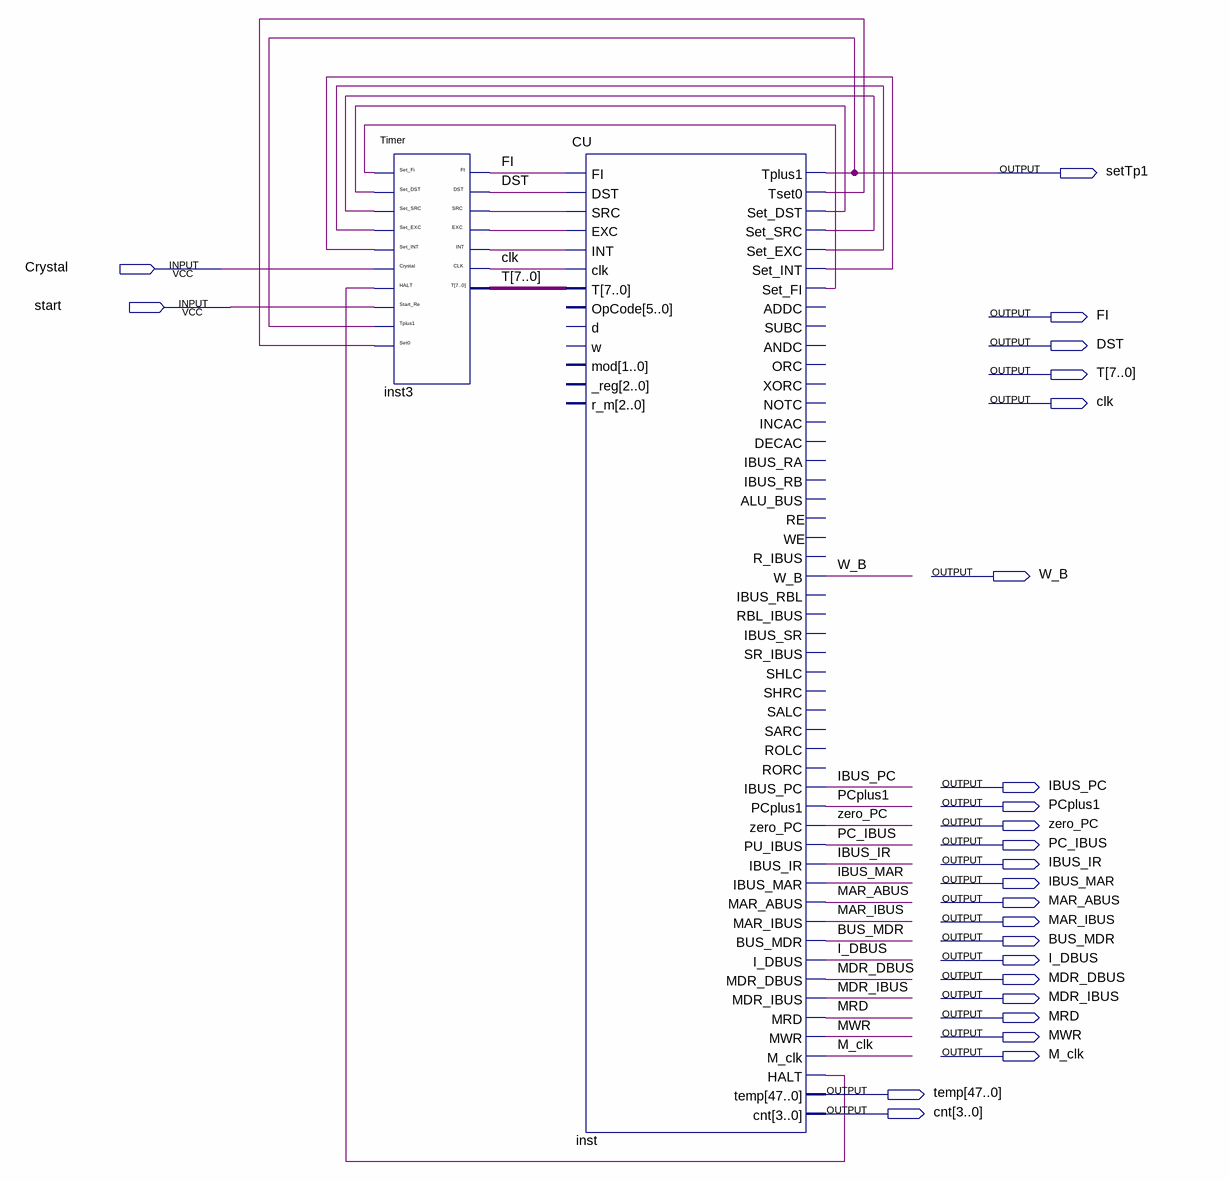
[diagram p0: schematic sheet]
// Quartus schematic CU_Timer.bdf as structural Verilog: 2 symbols, 25 pins
module CU_Timer (
  input  Crystal,
  input  start,
  output setTp1,
  output FI,
  output DST,
  output [7:0] T,
  output clk,
  output W_B,
  output IBUS_PC,
  output PCplus1,
  output zero_PC,
  output PC_IBUS,
  output IBUS_IR,
  output IBUS_MAR,
  output MAR_ABUS,
  output MAR_IBUS,
  output BUS_MDR,
  output I_DBUS,
  output MDR_DBUS,
  output MDR_IBUS,
  output MRD,
  output MWR,
  output M_clk,
  output [47:0] temp,
  output [3:0] cnt
);

  wire inst3_exc, inst3_int, inst3_src, inst_halt, inst_set_dst, inst_set_exc, inst_set_fi, inst_set_int,
       inst_set_src, inst_tset0;

  Timer inst3 (
    .Set_Fi(inst_set_fi), .Set_DST(inst_set_dst), .Set_SRC(inst_set_src), .Set_EXC(inst_set_exc),
    .Set_INT(inst_set_int), .Crystal(Crystal), .HALT(inst_halt), .Start_Re(start), .Tplus1(setTp1),
    .Set0(inst_tset0), .FI(FI), .DST(DST), .SRC(inst3_src), .EXC(inst3_exc), .INT(inst3_int), .CLK(clk), .T(T));
  CU inst (
    .FI(FI), .DST(DST), .SRC(inst3_src), .EXC(inst3_exc), .INT(inst3_int), .clk(clk), .T(T), .Tplus1(setTp1),
    .Tset0(inst_tset0), .Set_DST(inst_set_dst), .Set_SRC(inst_set_src), .Set_EXC(inst_set_exc),
    .Set_INT(inst_set_int), .Set_FI(inst_set_fi), .W_B(W_B), .IBUS_PC(IBUS_PC), .PCplus1(PCplus1),
    .zero_PC(zero_PC), .PU_IBUS(PC_IBUS), .IBUS_IR(IBUS_IR), .IBUS_MAR(IBUS_MAR), .MAR_ABUS(MAR_ABUS),
    .MAR_IBUS(MAR_IBUS), .BUS_MDR(BUS_MDR), .I_DBUS(I_DBUS), .MDR_DBUS(MDR_DBUS), .MDR_IBUS(MDR_IBUS),
    .MRD(MRD), .MWR(MWR), .M_clk(M_clk), .HALT(inst_halt), .temp(temp), .cnt(cnt));  // open: OpCode, d, w, mod, _reg, r_m, ADDC, SUBC, ANDC, ORC, XORC, NOTC, INCAC, DECAC, IBUS_RA, IBUS_RB, ALU_BUS, RE, WE, R_IBUS, IBUS_RBL, RBL_IBUS, IBUS_SR, SR_IBUS, SHLC, SHRC, SALC, SARC, ROLC, RORC
endmodule
